# Altium schematic sheet STB_TempControl.SchDoc: STB Sensor Board - Temperature Control
size A4; Author: mayerph; DrawnBy: mayerph; Organization: PBL; Revision: A; SheetNumber: 4; SheetTotal: 8
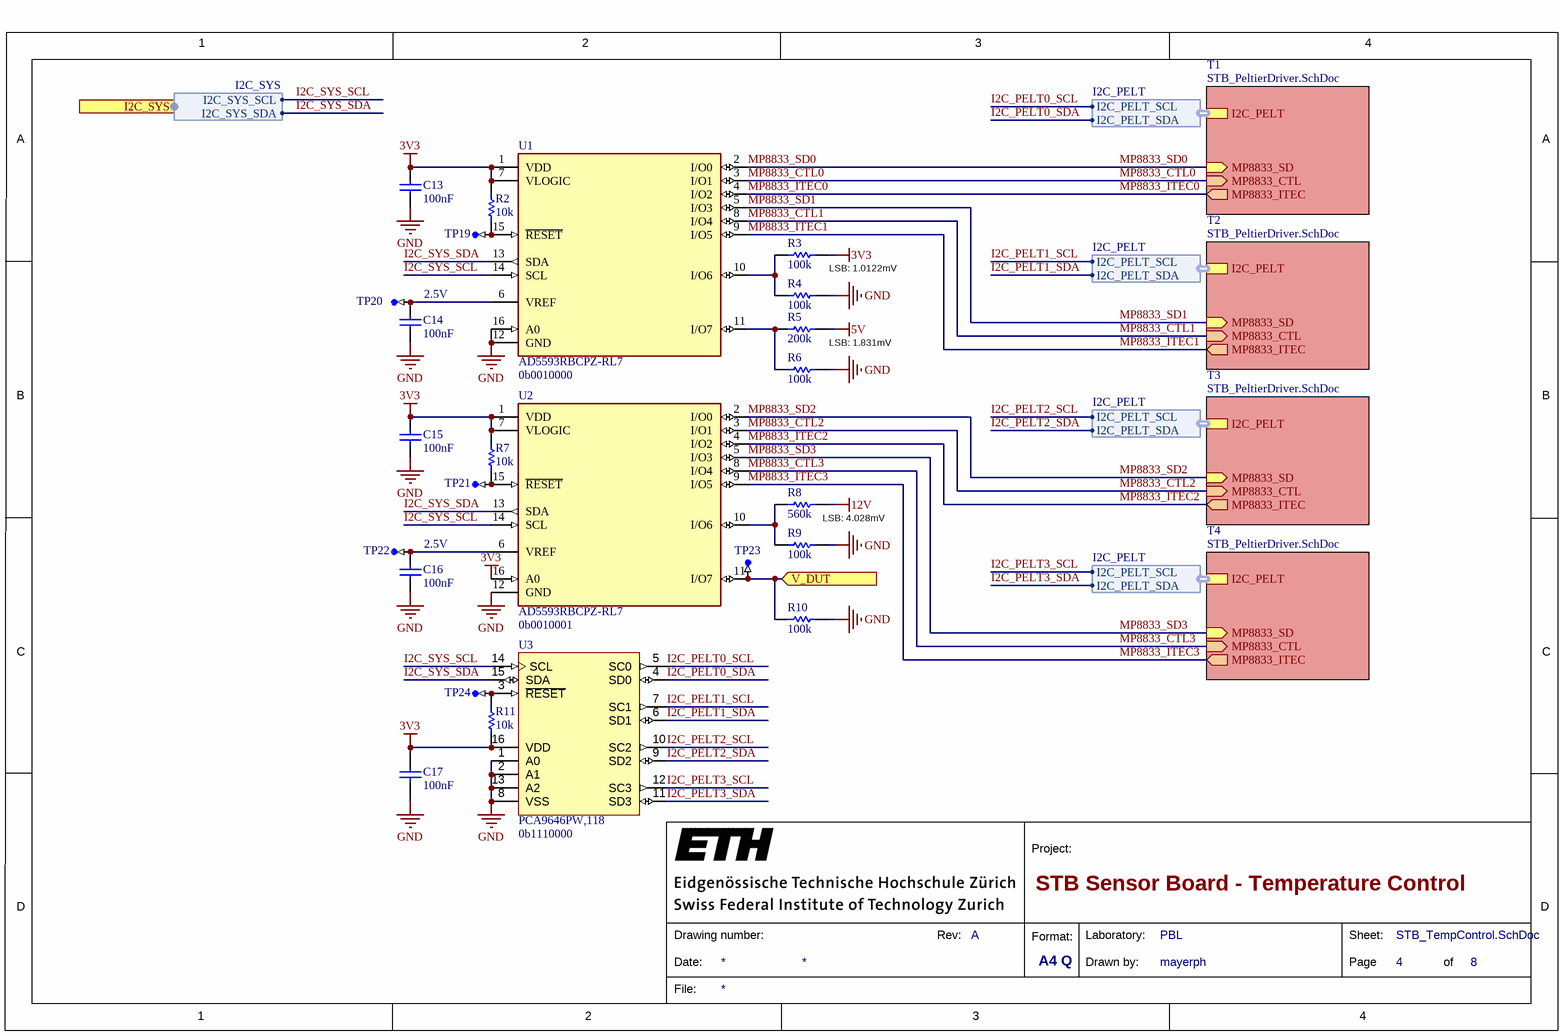
[diagram p0: STB_TempControl.SchDoc]

## Parts
C13  100nF  [CAPC1050X55X23LL05T13]
C14  100nF  [CAPC1050X55X23LL05T13]
C15  100nF  [CAPC1050X55X23LL05T13]
C16  100nF  [CAPC1050X55X23LL05T13]
C17  100nF  [CAPC1050X55X23LL05T13]
R2  10k  [RESC1005X40X25LL05T05]
R3  100k  [RESC1005X40X25LL05T10]
R4  100k  [RESC1005X40X25LL05T10]
R5  200k  [RESC1005X40X25LL05T10]
R6  100k  [RESC1005X40X25LL05T10]
R7  10k  [RESC1005X40X25LL05T05]
R8  560k  [RESC1005X40X25LL05T05]
R9  100k  [RESC1005X40X25LL05T10]
R10  100k  [RESC1005X40X25LL05T10]
R11  10k  [RESC1005X40X25LL05T05]
TP19  testPoint_1mm  [TP-SM-C-100]  (value not drawn)  (no BOM)
TP20  testPoint_1mm  [TP-SM-C-100]  (value not drawn)  (no BOM)
TP21  testPoint_1mm  [TP-SM-C-100]  (value not drawn)  (no BOM)
TP22  testPoint_1mm  [TP-SM-C-100]  (value not drawn)  (no BOM)
TP23  testPoint_1mm  [TP-SM-C-100]  (value not drawn)  (no BOM)
TP24  testPoint_1mm  [TP-SM-C-100]  (value not drawn)  (no BOM)
U1  AD5593RBCPZ-RL7  [FP-CP-16-32-IPC_C]
U2  AD5593RBCPZ-RL7  [FP-CP-16-32-IPC_C]
U3  PCA9646PW,118  [TSSOP-16_N]

## Sub-sheets
T1 = STB_PeltierDriver.SchDoc: I2C_PELT (harness I2C_PELT), MP8833_SD (in), MP8833_ITEC (out), MP8833_CTL (in)
T2 = STB_PeltierDriver.SchDoc: I2C_PELT (harness I2C_PELT), MP8833_SD (in), MP8833_ITEC (out), MP8833_CTL (in)
T3 = STB_PeltierDriver.SchDoc: I2C_PELT (harness I2C_PELT), MP8833_SD (in), MP8833_ITEC (out), MP8833_CTL (in)
T4 = STB_PeltierDriver.SchDoc: I2C_PELT (harness I2C_PELT), MP8833_SD (in), MP8833_ITEC (out), MP8833_CTL (in)

## Ports
I2C_SYS (harness I2C_SYS), V_DUT (in)

## Harnesses
I2C_SYS: I2C_SYS_SDA, I2C_SYS_SCL
I2C_PELT: I2C_PELT_SDA, I2C_PELT_SCL

## Nets
3V3: C13.2 C15.2 C17.2 R2.2 R3.1 R7.2 R11.1 U1.1(VDD) U1.7(VLOGIC) U2.1(VDD) U2.7(VLOGIC) U2.16(A0) U3.16(VDD)
5V: R5.1
12V: R8.1
GND: C13.1 C14.1 C15.1 C16.1 C17.1 R4.1 R6.1 R9.1 R10.1 U1.12(GND) U1.16(A0) U2.12(GND) U3.1(A0) U3.2(A1) U3.8(VSS) U3.13(A2)
I2C_PELT0_SCL: U3.5(SC0) ; sheet T1/I2C_PELT.I2C_PELT_SCL
I2C_PELT0_SDA: U3.4(SD0) ; sheet T1/I2C_PELT.I2C_PELT_SDA
I2C_PELT1_SCL: U3.7(SC1) ; sheet T2/I2C_PELT.I2C_PELT_SCL
I2C_PELT1_SDA: U3.6(SD1) ; sheet T2/I2C_PELT.I2C_PELT_SDA
I2C_PELT2_SCL: U3.10(SC2) ; sheet T3/I2C_PELT.I2C_PELT_SCL
I2C_PELT2_SDA: U3.9(SD2) ; sheet T3/I2C_PELT.I2C_PELT_SDA
I2C_PELT3_SCL: U3.12(SC3) ; sheet T4/I2C_PELT.I2C_PELT_SCL
I2C_PELT3_SDA: U3.11(SD3) ; sheet T4/I2C_PELT.I2C_PELT_SDA
I2C_SYS_SCL: U1.14(SCL) U2.14(SCL) U3.14(SCL) ; port I2C_SYS.I2C_SYS_SCL
I2C_SYS_SDA: U1.13(SDA) U2.13(SDA) U3.15(SDA) ; port I2C_SYS.I2C_SYS_SDA
MP8833_CTL0: U1.3(I/O1) ; sheet T1/MP8833_CTL
MP8833_CTL1: U1.8(I/O4) ; sheet T2/MP8833_CTL
MP8833_CTL2: U2.3(I/O1) ; sheet T3/MP8833_CTL
MP8833_CTL3: U2.8(I/O4) ; sheet T4/MP8833_CTL
MP8833_ITEC0: U1.4(I/O2) ; sheet T1/MP8833_ITEC
MP8833_ITEC1: U1.9(I/O5) ; sheet T2/MP8833_ITEC
MP8833_ITEC2: U2.4(I/O2) ; sheet T3/MP8833_ITEC
MP8833_ITEC3: U2.9(I/O5) ; sheet T4/MP8833_ITEC
MP8833_SD0: U1.2(I/O0) ; sheet T1/MP8833_SD
MP8833_SD1: U1.5(I/O3) ; sheet T2/MP8833_SD
MP8833_SD2: U2.2(I/O0) ; sheet T3/MP8833_SD
MP8833_SD3: U2.5(I/O3) ; sheet T4/MP8833_SD
V_DUT: R10.2 TP23.TP U2.11(I/O7) ; port V_DUT
NetC14_2: C14.2 TP20.TP U1.6(VREF)
NetC16_2: C16.2 TP22.TP U2.6(VREF)
NetR2_1: R2.1 TP19.TP U1.15(~{RESET})
NetR3_2: R3.2 R4.2 U1.10(I/O6)
NetR5_2: R5.2 R6.2 U1.11(I/O7)
NetR7_1: R7.1 TP21.TP U2.15(~{RESET})
NetR8_2: R8.2 R9.2 U2.10(I/O6)
NetR11_2: R11.2 TP24.TP U3.3(~{RESET})

## Notes on the sheet
- 2.5V
- LSB: 1.0122mV
- 0b0010000
- LSB: 1.831mV
- LSB: 4.028mV
- 0b0010001
- (near U3) 0b1110000
- 1
- 2
- 3
- 4
- A
- B
- C
- Project:
- D
- Date:
- Drawing number:
- Rev:
- Format:
- A4 Q
- Drawn by:
- Laboratory:
- Page
- Sheet:
- of
- File:

## Library data of the parts
C13-C17 = CMP-2000-05439-1: Chip Capacitor, 100 nF, +/- 10%, 16 V, -55 to 125 degC, 0402 (1005 Metric), RoHS, Tape and Reel; Manufacturer: Samsung Electro-Mechanics; Manufacturer Part Number: CL05B104KO5NNNC; Dielectric: X7R; Rated Voltage: 16V; Dielectric Material: Ceramic; Multilayer: Yes; Case Size/Dimension: 0402; Tolerance (%): ±10%; Value: 100nF; Manufacturer URL: http://www.samsungsem.com/global/index.jsp; Datasheet URL: https://datasheet.ciiva.com/29198/458718-da-01-en-vs-kondensator-0402-29198423.pdf; Datasheet Version: Nov-10; Supplier 1: Digi-Key; Supplier Part Number 1: 1276-1001-6-ND; RoHS: Yes; Category: Ceramic Capacitors; Stock 1: 24854634; Pricing 1: 1=0.10000, 10=0.02400, 50=0.01300, 100=0.01050, 500=0.00752, 1000=0.00592, 2500=0.00538, 5000=0.00495 (USD); Mount: Surface Mount; Number of Pins: 2; Package Shape: Rectangular; Size Code: 0402; Terminal Finish: Nickel; Min Operating Temperature: -55°C; Max Operating Temperature: 125°C; JESD-609 Code: e3; Capacitor Type: Ceramic; Negative Tolerance: 10%; Packaging: Tape and Reel; Positive Tolerance: 10%; Rated DC Voltage (URdc): 16V; Temperature Characteristics Code: X7R; Termination: Wraparound; Package Style: SMTMeter; Length: 1mm; Width: 0.5mm; Height: 0.55mm; REACH SVHC: Yes; RoHS Compliant: Yes; ComponentLink1URL: https://datasheet.ciiva.com:443/pdfs/VipMasterIC/IC/SEMS/SEMS-S-A0008384515/SEMS-S-A0008872921-1.pdf?src-supplier=IHS+Markit; ComponentLink1Description: https://datasheet.ciiva.com:443/pdfs/VipMasterIC/IC/SEMS/SEMS-S-A0008384515/SEMS-S-A0008872921-1.pdf?src-supplier=IHS+Markit; ComponentLink2URL: https://datasheet.ciiva.com/26920/getdatasheetpartid-359683-26920169.pdf?src-supplier=Verical; ComponentLink2Description: https://datasheet.ciiva.com/26920/getdatasheetpartid-359683-26920169.pdf?src-supplier=Verical; ComponentLink3URL: https://datasheet.ciiva.com/29198/458718-da-01-en-vs-kondensator-0402-29198423.pdf?src-supplier=Conrad; ComponentLink3Description: https://datasheet.ciiva.com/29198/458718-da-01-en-vs-kondensator-0402-29198423.pdf?src-supplier=Conrad; ComponentLink4URL: https://datasheet.ciiva.com/26309/mlcc-catalogdownload2013-eng-26309003.pdf?src-supplier=Distrelec; ComponentLink4Description: https://datasheet.ciiva.com/26309/mlcc-catalogdownload2013-eng-26309003.pdf?src-supplier=Distrelec; ComponentLink5URL: https://datasheet.ciiva.com/16208/cl05b104kq5nnnc-16208343.pdf?src-supplier=Future+Electronics; ComponentLink5Description: https://datasheet.ciiva.com/16208/cl05b104kq5nnnc-16208343.pdf?src-supplier=Future+Electronics
R2 R7 R11 = CMP-2000-07588-1: Chip Resistor, 10 KOhm, +/- 1%, 0.1 W, -55 to 155 degC, 0402 (1005 Metric), RoHS, Tape and Reel; Manufacturer: Panasonic; Manufacturer Part Number: ERJ-2RKF1002X; Power Rating: 100mW; Voltage Rating: 50V; Value: 10 kOhm; Case\/Package: 0402; Temperature Coefficient: 100ppm\/degreesC; Rated Temperature: 70°C; Package Height: 0.35mm; Package Length: 1mm; Package Width: 0.5mm; Reference Standard: AEC-Q200; RoHSCompliant: True; Lead Free: LeadFree; Package Quantity: 1; Contact Plating: Tin; Length: 1mm; Radiation Hardening: No; REACH SVHC: NoSVHC; Max Operating Temperature: 155degC; Depth: 0.5mm; Case Code (Imperial): 0402; Military Standard: Not; Package Description: 2-Pin Surface Mount Device, Body 1 x 0.5 mm; Termination: SMD/SMT; Case Code (Metric): 1005; Height: 0.35mm; Packaging: TapeandReel; Voltage Rating (DC): 50V; Package Reference: 402; Number of Pins: 2; Tolerance: 1%; Mounting Technology: SurfaceMount; Width: 0.02inch; Mount: SurfaceMount; Datasheet URL: https://industrial.panasonic.com/cdbs/www-data/pdf/RDA0000/AOA0000C304.pdf; Composition: ThickFilm; Datasheet Version: 02/2017; Manufacturer URL: http://www.panasonic.com/; Max Power Dissipation: 100mW; Number of Terminations: 2; Min Operating Temperature: -55degC; Supplier 1: Digi-Key; Supplier Part Number 1: P10.0KLDKR-ND; RoHS: Yes; Category: Chip SMD Resistors; Stock 1: 108; Pricing 1: 1=0.10000, 10=0.03300, 100=0.01330, 1000=0.00599, 2500=0.00520, 5000=0.00429 (USD); Size Code: 0402; Terminal Finish: Nickel; Package Shape: Rectangular; Resistor Type: FIXED RESISTOR; Rated Power Dissipation (P): 100mW; Technology: METAL GLAZE/THICK FILM; Working Voltage: 50V; Construction: Rectangular; Package Style: SMTMeter; JESD-609 Code: e3; RoHS Compliant: Yes; ComponentLink1URL: https://datasheet.ciiva.com:443/pdfs/VipMasterIC/IC/PANA/PANA-S-A0009889626/PANA-S-A0009889626-1.pdf?src-supplier=IHS+Markit; ComponentLink1Description: https://datasheet.ciiva.com:443/pdfs/VipMasterIC/IC/PANA/PANA-S-A0009889626/PANA-S-A0009889626-1.pdf?src-supplier=IHS+Markit; ComponentLink2URL: https://datasheet.ciiva.com/11821/0900766b80f80784-11821171.pdf?src-supplier=RSComponents; ComponentLink2Description: https://datasheet.ciiva.com/11821/0900766b80f80784-11821171.pdf?src-supplier=RSComponents; ComponentLink3URL: https://datasheet.ciiva.com/27055/1987020-27055643.pdf?src-supplier=Jameco; ComponentLink3Description: https://datasheet.ciiva.com/27055/1987020-27055643.pdf?src-supplier=Jameco; ComponentLink4URL: https://datasheet.ciiva.com/43467/1678782-43467402.pdf?src-supplier=Farnell; ComponentLink4Description: https://datasheet.ciiva.com/43467/1678782-43467402.pdf?src-supplier=Farnell; ComponentLink5URL: https://datasheet.ciiva.com/28514/1678782-28514185.pdf?src-supplier=Element14; ComponentLink5Description: https://datasheet.ciiva.com/28514/1678782-28514185.pdf?src-supplier=Element14; ComponentLink6URL: https://datasheet.ciiva.com/24023/aoa0000ce2-24023017.pdf?src-supplier=Mouser; ComponentLink6Description: https://datasheet.ciiva.com/24023/aoa0000ce2-24023017.pdf?src-supplier=Mouser; ComponentLink7URL: https://datasheet.ciiva.com/16782/70260748-16782590.pdf?src-supplier=Allied+Electronics; ComponentLink7Description: https://datasheet.ciiva.com/16782/70260748-16782590.pdf?src-supplier=Allied+Electronics; ComponentLink8URL: https://datasheet.ciiva.com/16786/70260748-16786734.pdf?src-supplier=Allied+Electronics; ComponentLink8Description: https://datasheet.ciiva.com/16786/70260748-16786734.pdf?src-supplier=Allied+Electronics; ComponentLink9URL: https://datasheet.ciiva.com/9194/aoa0000ce2-9194142.pdf?src-supplier=Avnet; ComponentLink9Description: https://datasheet.ciiva.com/9194/aoa0000ce2-9194142.pdf?src-supplier=Avnet; ComponentLink10URL: https://datasheet.ciiva.com/16199/aoa0000ce2-16199478.pdf?src-supplier=Future+Electronics; ComponentLink10Description: https://datasheet.ciiva.com/16199/aoa0000ce2-16199478.pdf?src-supplier=Future+Electronics; ComponentLink11URL: https://datasheet.ciiva.com/48531/aoa0000ce2-48531069.pdf?src-supplier=Avnet; ComponentLink11Description: https://datasheet.ciiva.com/48531/aoa0000ce2-48531069.pdf?src-supplier=Avnet; ComponentLink12URL: https://datasheet.ciiva.com/30201/aoa0000ce2-30201022.pdf?src-supplier=Onlinecomponents.com; ComponentLink12Description: https://datasheet.ciiva.com/30201/aoa0000ce2-30201022.pdf?src-supplier=Onlinecomponents.com
R3 R4 R6 R9 R10 = CMP-2002-07343-1: Part Number: RC0402FR-07100KL; Manufacturer: Yageo / Phycomp; Tolerance: 1%; Rated Power Dissipation (P): 62.5mW; Rated Temperature: 70°C; Value: 100 kOhm; Temperature Coefficient: 100ppm/°C; Working Voltage: 50V; Additional Feature: LASER TRIMMABLE; Package Height: 0.35mm; Package Length: 1mm; Package Width: 0.5mm; Supplier 1: Digi-Key; Supplier Part Number 1: 311-100KLRDKR-ND; Manufacturer Part Number: RC0402FR-07100KL; RoHS: Yes; Category: Chip SMD Resistors; Stock 1: 43269933; Pricing 1: 1=0.10000, 10=0.01500, 100=0.00600, 1000=0.00267, 2500=0.00232, 5000=0.00192 (USD); Mount: Surface Mount; Number of Pins: 2; Size Code: 0402; Terminal Finish: Nickel; Package Shape: Rectangular; Min Operating Temperature: -55°C; Max Operating Temperature: 155°C; Resistor Type: FIXED RESISTOR; Technology: METAL GLAZE/THICK FILM; Termination: Wraparound; JESD-609 Code: e3; Construction: Chip; Package Style: SMTMeter; Packaging: Tape and Reel; REACH SVHC: Yes; RoHS Compliant: Yes; ComponentLink1URL: https://datasheet.ciiva.com:443/pdfs/VipMasterIC/IC/YAGO/YAGO-S-A0008145938/YAGO-S-A0008145938-1.pdf?src-supplier=IHS+Markit; ComponentLink1Description: https://datasheet.ciiva.com:443/pdfs/VipMasterIC/IC/YAGO/YAGO-S-A0008145938/YAGO-S-A0008145938-1.pdf?src-supplier=IHS+Markit
R5 = CMP-2002-07497-1: Part Number: RC0402FR-07200KL; Manufacturer: Yageo / Phycomp; Tolerance: 1%; Rated Power Dissipation (P): 62.5mW; Rated Temperature: 70°C; Value: 200 kOhm; Temperature Coefficient: 100ppm/°C; Working Voltage: 50V; Additional Feature: LASER TRIMMABLE; Package Height: 0.35mm; Package Length: 1mm; Package Width: 0.5mm; Supplier 1: Digi-Key; Supplier Part Number 1: 311-200KLRDKR-ND; Manufacturer Part Number: RC0402FR-07200KL; RoHS: Yes; Category: Chip SMD Resistors; Stock 1: 2033311; Pricing 1: 1=0.10000, 10=0.01500, 100=0.00600, 1000=0.00267, 2500=0.00232, 5000=0.00192 (USD); Mount: Surface Mount; Number of Pins: 2; Size Code: 0402; Package Shape: Rectangular; Terminal Finish: Nickel; Min Operating Temperature: -55°C; Max Operating Temperature: 155°C; Resistor Type: FIXED RESISTOR; Construction: Chip; Package Style: SMTMeter; Technology: METAL GLAZE/THICK FILM; Termination: Wraparound; Packaging: Tape and Reel; JESD-609 Code: e3; REACH SVHC: Yes; RoHS Compliant: Yes; ComponentLink1URL: https://datasheet.ciiva.com:443/pdfs/VipMasterIC/IC/YAGO/YAGO-S-A0008145938/YAGO-S-A0008145938-1.pdf?src-supplier=IHS+Markit; ComponentLink1Description: https://datasheet.ciiva.com:443/pdfs/VipMasterIC/IC/YAGO/YAGO-S-A0008145938/YAGO-S-A0008145938-1.pdf?src-supplier=IHS+Markit; ComponentLink2URL: https://datasheet.ciiva.com/7849/1018594-7849897.pdf?src-supplier=Element14; ComponentLink2Description: https://datasheet.ciiva.com/7849/1018594-7849897.pdf?src-supplier=Element14; ComponentLink3URL: https://datasheet.ciiva.com/7849/1018594-7849896.pdf?src-supplier=Element14; ComponentLink3Description: https://datasheet.ciiva.com/7849/1018594-7849896.pdf?src-supplier=Element14; ComponentLink4URL: https://datasheet.ciiva.com/46394/1018594-46394953.pdf?src-supplier=Element14; ComponentLink4Description: https://datasheet.ciiva.com/46394/1018594-46394953.pdf?src-supplier=Element14; ComponentLink5URL: https://datasheet.ciiva.com/2453/pyu-r-int-thick-7-2453557.pdf?src-supplier=Digi-Key; ComponentLink5Description: https://datasheet.ciiva.com/2453/pyu-r-int-thick-7-2453557.pdf?src-supplier=Digi-Key; ComponentLink6URL: https://datasheet.ciiva.com/2453/pyu-r-int-thick-7-2453558.pdf?src-supplier=Digi-Key; ComponentLink6Description: https://datasheet.ciiva.com/2453/pyu-r-int-thick-7-2453558.pdf?src-supplier=Digi-Key; ComponentLink7URL: https://datasheet.ciiva.com/2453/pyu-r-int-thick-7-2453556.pdf?src-supplier=Digi-Key; ComponentLink7Description: https://datasheet.ciiva.com/2453/pyu-r-int-thick-7-2453556.pdf?src-supplier=Digi-Key; ComponentLink8URL: https://datasheet.ciiva.com/12667/pyu-rc0402-51-rohs-l-6-r-12667911.pdf?src-supplier=Mouser; ComponentLink8Description: https://datasheet.ciiva.com/12667/pyu-rc0402-51-rohs-l-6-r-12667911.pdf?src-supplier=Mouser; ComponentLink9URL: https://datasheet.ciiva.com/15189/getdatasheetpartid-323720-15189381.pdf?src-supplier=Verical; ComponentLink9Description: https://datasheet.ciiva.com/15189/getdatasheetpartid-323720-15189381.pdf?src-supplier=Verical; ComponentLink10URL: https://datasheet.ciiva.com/16740/pyu-rc0402-51-rohs-l-6-r-16740636.pdf?src-supplier=Future+Electronics; ComponentLink10Description: https://datasheet.ciiva.com/16740/pyu-rc0402-51-rohs-l-6-r-16740636.pdf?src-supplier=Future+Electronics
R8 = CMP-2002-01162-1: Manufacturer: Panasonic; Part Number: ERJ2RKF5603X; Manufacturer Part Number: ERJ-2RKF5603X; Tolerance: 1%; Rated Power Dissipation (P): 100mW; Rated Temperature: 70°C; Value: 560 kOhm; Temperature Coefficient: 100ppm/°C; Working Voltage: 50V; Package Height: 0.35mm; Package Length: 1mm; Package Width: 0.5mm; Reference Standard: AEC-Q200; Supplier 1: Digi-Key; Supplier Part Number 1: P560KLDKR-ND; RoHS: Yes; Category: Chip SMD Resistors; Stock 1: 874640; Pricing 1: 1=0.10000, 10=0.03300, 100=0.01330, 1000=0.00599, 2500=0.00520, 5000=0.00429 (USD); Mount: Surface Mount; Number of Pins: 2; Size Code: 0402; Terminal Finish: Nickel; Package Shape: Rectangular; Min Operating Temperature: -55°C; Max Operating Temperature: 155°C; Package Style: SMTMeter; Packaging: Tape and Reel; Termination: Wraparound; JESD-609 Code: e3; Resistor Type: FIXED RESISTOR; Construction: Rectangular; Technology: METAL GLAZE/THICK FILM; REACH SVHC: Yes; RoHS Compliant: Yes; ComponentLink1URL: https://datasheet.ciiva.com:443/pdfs/VipMasterIC/IC/PANA/PANA-S-A0009889626/PANA-S-A0009889626-1.pdf?src-supplier=IHS+Markit; ComponentLink1Description: https://datasheet.ciiva.com:443/pdfs/VipMasterIC/IC/PANA/PANA-S-A0009889626/PANA-S-A0009889626-1.pdf?src-supplier=IHS+Markit; ComponentLink2URL: https://datasheet.ciiva.com/11821/0900766b80f80784-11821338.pdf?src-supplier=RSComponents; ComponentLink2Description: https://datasheet.ciiva.com/11821/0900766b80f80784-11821338.pdf?src-supplier=RSComponents; ComponentLink3URL: https://datasheet.ciiva.com/6075/aoa0000ce2-6075366.pdf?src-supplier=Farnell; ComponentLink3Description: https://datasheet.ciiva.com/6075/aoa0000ce2-6075366.pdf?src-supplier=Farnell; ComponentLink4URL: https://datasheet.ciiva.com/7710/aoa0000ce2-7710746.pdf?src-supplier=Element14; ComponentLink4Description: https://datasheet.ciiva.com/7710/aoa0000ce2-7710746.pdf?src-supplier=Element14; ComponentLink5URL: https://datasheet.ciiva.com/22687/1678782-22687463.pdf?src-supplier=Element14; ComponentLink5Description: https://datasheet.ciiva.com/22687/1678782-22687463.pdf?src-supplier=Element14; ComponentLink6URL: https://datasheet.ciiva.com/24026/aoa0000ce2-24026571.pdf?src-supplier=Mouser; ComponentLink6Description: https://datasheet.ciiva.com/24026/aoa0000ce2-24026571.pdf?src-supplier=Mouser; ComponentLink7URL: https://datasheet.ciiva.com/16771/70260748-16771559.pdf?src-supplier=Allied+Electronics; ComponentLink7Description: https://datasheet.ciiva.com/16771/70260748-16771559.pdf?src-supplier=Allied+Electronics; ComponentLink8URL: https://datasheet.ciiva.com/16758/70260748-16758700.pdf?src-supplier=Allied+Electronics; ComponentLink8Description: https://datasheet.ciiva.com/16758/70260748-16758700.pdf?src-supplier=Allied+Electronics; ComponentLink9URL: https://datasheet.ciiva.com/9181/aoa0000ce2-9181118.pdf?src-supplier=Avnet; ComponentLink9Description: https://datasheet.ciiva.com/9181/aoa0000ce2-9181118.pdf?src-supplier=Avnet
TP19-TP24 = testPoint_1mm: testPoint 1mm
U1 U2 = CMP-09080-000014-1: IC ADC/DAC 12BIT 16LFCSP; Manufacturer: Analog Devices; Integral Nonlinearity (INL): 2LSB; Supply Type: Analog; Number of D/A Converters: 8; Number of A/D Converters: 1; Interface: I2C; Resolution: 12b; Converter Type: ADC; Settling Time: 6us; Package Body Material: Plastic; Analog IC - Other Type: ANALOG CIRCUIT; Supply Voltage-Max (Vsup): 5.5V; Supply Voltage-Min (Vsup): 2.7V; Supply Voltage-Nom (Vsup): 3V; Number of Pins: 16; Packaging: Cut Tape; Max Operating Temperature: 105°C; RoHS Compliant: Yes; Mount: Surface Mount; Min Operating Temperature: -40°C; Lead Free: Contains Lead; Series: *; Supplier 1: Digi-Key; Supplier Part Number 1: 505-AD5593RBCPZ-RL7DKR-ND; Manufacturer Part Number: AD5593RBCPZ-RL7; RoHS: Yes; Category: Analog to Digital Converters (ADCs); Stock 1: 8778; Pricing 1: 1=10.17000, 10=9.18400, 25=8.75720, 100=7.60380, 250=7.26208, 500=6.62128 (USD); Package Code: VFBGA; Package Shape: Square; Number of Functions: 1; Package Style: GRID ARRAY, VERY THIN PROFILE, FINE PITCHMeter; Surface Mount: Yes; Terminal Form: Ball; Terminal Position: BOTTOM; Length: 3mm; Width: 3mm; Height - Seated (Max): 0.8mm; Terminal Pitch: 0.5mm; Temperature Grade: INDUSTRIAL; REACH SVHC: Yes; ComponentLink1URL: https://datasheet.ciiva.com:443/pdfs/VipMasterIC/IC/ANDI/ANDI-S-A0006763626/ANDI-S-A0006763626-1.pdf?src-supplier=IHS+Markit; ComponentLink1Description: https://datasheet.ciiva.com:443/pdfs/VipMasterIC/IC/ANDI/ANDI-S-A0006763626/ANDI-S-A0006763626-1.pdf?src-supplier=IHS+Markit; ComponentLink2URL: http://www.mouser.com/ds/2/609/AD5593R-534139.pdf?src-supplier=Mouser; ComponentLink2Description: http://www.mouser.com/ds/2/609/AD5593R-534139.pdf?src-supplier=Mouser; ComponentLink3URL: http://www.analog.com/media/en/technical-documentation/data-sheets/AD5593R.pdf?src-supplier=Avnet; ComponentLink3Description: http://www.analog.com/media/en/technical-documentation/data-sheets/AD5593R.pdf?src-supplier=Avnet; ComponentLink4URL: http://www.analog.com/media/en/technical-documentation/data-sheets/AD5593R.pdf?src-supplier=Digi-Key; ComponentLink4Description: http://www.analog.com/media/en/technical-documentation/data-sheets/AD5593R.pdf?src-supplier=Digi-Key
U3 = CMP-02071-1: Buffer, ReDriver 4 Channel 1MHz 16-TSSOP; Mfr: NXP USA Inc.; Manufacturer: NXP Semiconductors; Logic IC Type: MULTIPLEXER; Product Status: Active; Input: 2-Wire Bus; Number of Channels: 4; Delay Time: 100ns; Voltage - Supply: 2.7V ~ 5.5V; Current - Supply: 1µA; Description: Bus Exchanger, 9646 Series, 1-Func, 1-Bit, True Output, CMOS, PDSO16; Moisture Sensitivity Level: 1; REACH SVHC: Yes; RoHS Compliant: Yes; Series: -; Type: Buffer, ReDriver; Applications: I²C; Output: 2-Wire Bus; Data Rate (Max): 1MHz; Signal Conditioning: -; Operating Temperature: -40°C ~ 85°C; Mounting Type: Surface Mount; Supplier Device Package: 16-TSSOP; Base Product Number: PCA9646; Supplier 1: Digi-Key; Supplier Part Number 1: 568-6704-6-ND; Manufacturer Part Number: PCA9646PW,118; RoHS: Yes; Category: Interface ICs; Stock 1: 2391; Pricing 1: 1=7.63000, 10=6.89100, 25=6.57040, 100=5.70510, 250=5.44872, 500=5.06716 (USD); Reach SVHC Compliant: Yes; ComponentLink1URL: https://datasheet.ciiva.com:443/pdfs/VipMasterIC/IC/PHGL/PHGL-S-A0001063153/PHGL-S-A0001063153-1.pdf?src-supplier=IHS+Markit; ComponentLink1Description: https://datasheet.ciiva.com:443/pdfs/VipMasterIC/IC/PHGL/PHGL-S-A0001063153/PHGL-S-A0001063153-1.pdf?src-supplier=IHS+Markit; ComponentLink2URL: https://datasheet.ciiva.com/1784/pca9646-1784176.pdf?src-supplier=Digi-Key; ComponentLink2Description: https://datasheet.ciiva.com/1784/pca9646-1784176.pdf?src-supplier=Digi-Key; ComponentLink3URL: https://datasheet.ciiva.com/1784/pca9646-1784174.pdf?src-supplier=Digi-Key; ComponentLink3Description: https://datasheet.ciiva.com/1784/pca9646-1784174.pdf?src-supplier=Digi-Key; ComponentLink4URL: https://datasheet.ciiva.com/26908/getdatasheetpartid-340522-26908235.pdf?src-supplier=Verical; ComponentLink4Description: https://datasheet.ciiva.com/26908/getdatasheetpartid-340522-26908235.pdf?src-supplier=Verical; ComponentLink5URL: https://datasheet.ciiva.com/3169/pca9646-3169261.pdf?src-supplier=Avnet; ComponentLink5Description: https://datasheet.ciiva.com/3169/pca9646-3169261.pdf?src-supplier=Avnet; ComponentLink6URL: https://datasheet.ciiva.com/1784/pca9646-1784175.pdf?src-supplier=Digi-Key; ComponentLink6Description: https://datasheet.ciiva.com/1784/pca9646-1784175.pdf?src-supplier=Digi-Key